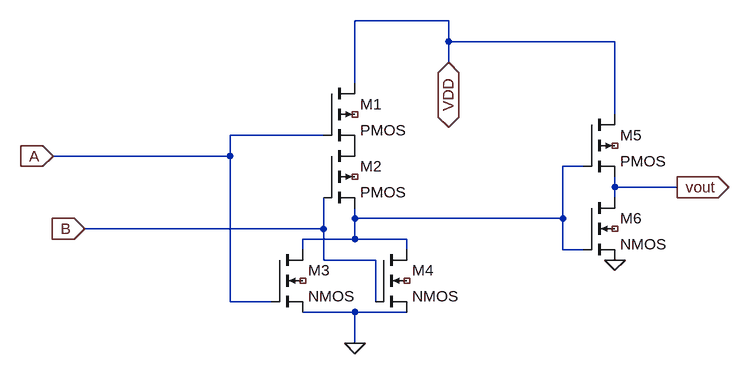
[diagram p0: schematic OR_Static_VDD.asc]
OR_Static_VDD.asc, the LTspice schematic file:
Version 4
SHEET 1 880 680
WIRE 304 -64 160 -64
WIRE 304 -32 304 -64
WIRE 560 -32 304 -32
WIRE 304 0 304 -32
WIRE 160 32 160 -64
WIRE 560 80 560 -32
WIRE 112 112 -32 112
WIRE -32 144 -32 112
WIRE -32 144 -304 144
WIRE 512 160 480 160
WIRE 560 192 560 176
WIRE 656 192 560 192
WIRE 560 208 560 192
WIRE 160 240 160 224
WIRE 480 240 480 160
WIRE 480 240 160 240
WIRE 112 256 112 208
WIRE 112 256 -256 256
WIRE 160 272 160 240
WIRE 160 272 80 272
WIRE 240 272 160 272
WIRE 80 288 80 272
WIRE 240 288 240 272
WIRE 480 288 480 240
WIRE 512 288 480 288
WIRE 112 304 112 256
WIRE 192 304 112 304
WIRE -32 368 -32 144
WIRE 32 368 -32 368
WIRE 192 368 192 304
WIRE 160 384 80 384
WIRE 240 384 160 384
WIRE 160 432 160 384
FLAG 160 432 0
FLAG 560 304 0
FLAG 656 192 vout
IOPIN 656 192 Out
FLAG -304 144 A
IOPIN -304 144 In
FLAG -256 256 B
IOPIN -256 256 In
FLAG 304 0 VDD
IOPIN 304 0 BiDir
SYMBOL pmos4 112 32 R0
SYMATTR InstName M1
SYMBOL pmos4 112 128 R0
SYMATTR InstName M2
SYMBOL nmos4 32 288 R0
SYMATTR InstName M3
SYMBOL nmos4 192 288 R0
SYMATTR InstName M4
SYMBOL pmos4 512 80 R0
SYMATTR InstName M5
SYMBOL nmos4 512 208 R0
SYMATTR InstName M6

The netlist it stands for:
* OR_Static_VDD.asc
M1 VDD A P001 NC_01 PMOS
M2 P001 B N001 NC_02 PMOS
M3 N001 A 0 NC_03 NMOS
M4 N001 B 0 NC_04 NMOS
M5 VDD N001 vout NC_05 PMOS
M6 vout N001 0 NC_06 NMOS
.model NMOS NMOS
.model PMOS PMOS
.lib standard.mos
.backanno
.end